# Altium schematic sheet Sheet4.SchDoc
size 420 x 297 mm; Author: ALTIUM GOSTBOM2.0 KEV; SheetNumber: 4; SheetTotal: 4; Обозначение_Код: ФЮРА.442576.001 Э3
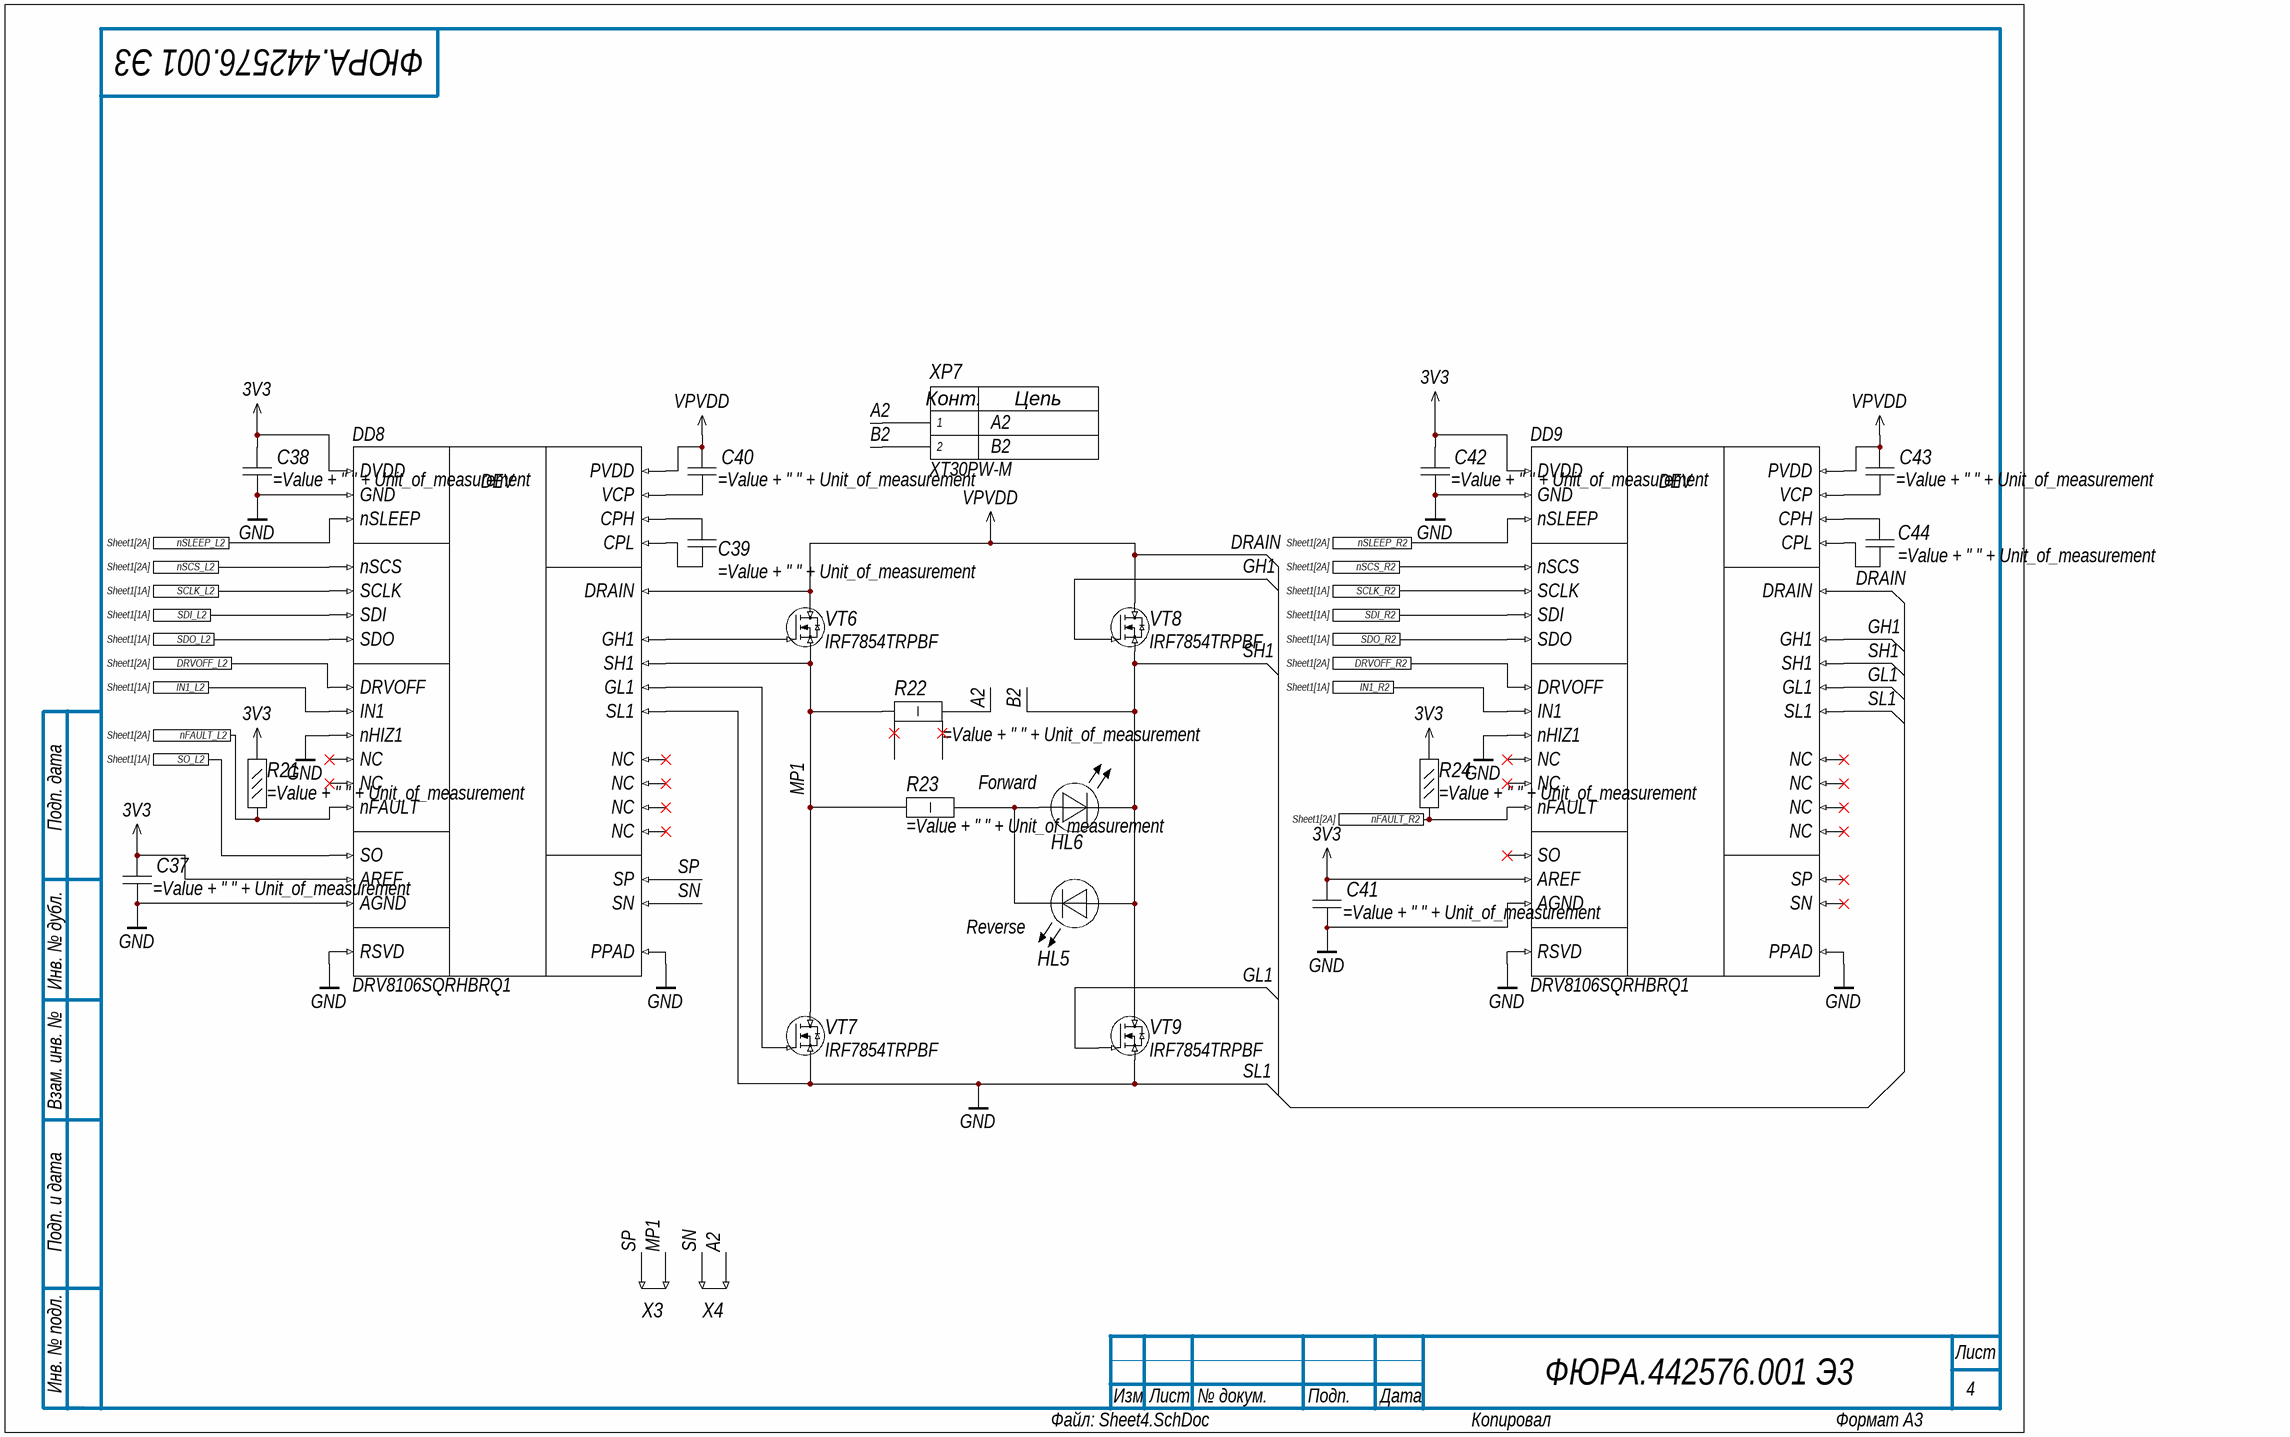
[diagram p0: Sheet4.SchDoc]

## Parts
C37  (no value)  [CAP_0603]
C38  (no value)  [CAP_0603]
C39  (no value)  [CAP_0603]
C40  (no value)  [CAP_0603]
C41  (no value)  [CAP_0603]
C42  (no value)  [CAP_0603]
C43  (no value)  [CAP_0603]
C44  (no value)  [CAP_0603]
DD8  DRV8106SQRHBRQ1  [VQFN32]
DD9  DRV8106SQRHBRQ1  [VQFN32]
HL5  3  [LED_0805]  (value not drawn)
HL6  3  [LED_0805]  (value not drawn)
R21  (no value)  [RES_0603]
R22  (no value)  [RES_2512]
R23  (no value)  [RES_2512]
R24  (no value)  [RES_0603]
VT6  IRF7854TRPBF  [SOP-8 WithoutTP]
VT7  IRF7854TRPBF  [SOP-8 WithoutTP]
VT8  IRF7854TRPBF  [SOP-8 WithoutTP]
VT9  IRF7854TRPBF  [SOP-8 WithoutTP]
X3  Обозначение при заказе  [NetTie]  (value not drawn)  (net tie, no BOM)
X4  Обозначение при заказе  [NetTie]  (value not drawn)  (net tie, no BOM)
XP7  XT30PW-M  [XT30PW-M]

## Ports
DRVOFF_L2 (see Sheet1[2A]), DRVOFF_R2 (see Sheet1[2A]), IN1_L2 (see Sheet1[1A]), IN1_R2 (see Sheet1[1A]), nFAULT_L2 (see Sheet1[2A]), nFAULT_R2 (see Sheet1[2A]), nSCS_L2 (see Sheet1[2A]), nSCS_R2 (see Sheet1[2A]), nSLEEP_L2 (see Sheet1[2A]), nSLEEP_R2 (see Sheet1[2A]), SCLK_L2 (see Sheet1[1A]), SCLK_R2 (see Sheet1[1A]), SDI_L2 (see Sheet1[1A]), SDI_R2 (see Sheet1[1A]), SDO_L2 (see Sheet1[1A]), SDO_R2 (see Sheet1[1A]), SO_L2 (see Sheet1[1A])

## Nets
3V3: C37.2 C38.2 C41.2 C42.2 DD8.2(DVDD) DD8.16(AREF) DD9.2(DVDD) DD9.16(AREF) R21.2 R24.2
DRAIN: C40.2 C43.2 DD8.28(DRAIN) DD8.29(PVDD) DD9.28(DRAIN) DD9.29(PVDD) VT6.3 VT8.3  [also labelled VPVDD]
SL1: C37.1 C38.1 C41.1 C42.1 DD8.0(PPAD) DD8.1(GND) DD8.8(nHIZ1) DD8.15(RSVD) DD8.17(AGND) DD8.23(SL1) DD9.0(PPAD) DD9.1(GND) DD9.8(nHIZ1) DD9.15(RSVD) DD9.17(AGND) DD9.23(SL1) VT7.2 VT9.2  [also labelled GND]
A2: R22.1 X4.2 XP7.1
B2: DD9.21(SH1) HL5.A HL6.C VT8.2 VT9.3 XP7.2  [also labelled SH1]
DRVOFF_L2: DD8.12(DRVOFF) ; port DRVOFF_L2
DRVOFF_R2: DD9.12(DRVOFF) ; port DRVOFF_R2
GH1: DD9.20(GH1) VT8.1
GL1: DD9.22(GL1) VT9.1
IN1_L2: DD8.7(IN1) ; port IN1_L2
IN1_R2: DD9.7(IN1) ; port IN1_R2
MP1: DD8.21(SH1) R22.2 R23.1 VT6.2 VT7.3 X3.2
nFAULT_L2: DD8.13(nFAULT) R21.1 ; port nFAULT_L2
nFAULT_R2: DD9.13(nFAULT) R24.1 ; port nFAULT_R2
nSCS_L2: DD8.3(nSCS) ; port nSCS_L2
nSCS_R2: DD9.3(nSCS) ; port nSCS_R2
nSLEEP_L2: DD8.11(nSLEEP) ; port nSLEEP_L2
nSLEEP_R2: DD9.11(nSLEEP) ; port nSLEEP_R2
SCLK_L2: DD8.4(SCLK) ; port SCLK_L2
SCLK_R2: DD9.4(SCLK) ; port SCLK_R2
SDI_L2: DD8.5(SDI) ; port SDI_L2
SDI_R2: DD9.5(SDI) ; port SDI_R2
SDO_L2: DD8.6(SDO) ; port SDO_L2
SDO_R2: DD9.6(SDO) ; port SDO_R2
SN: DD8.19(SN) X4.1
SO_L2: DD8.14(SO) ; port SO_L2
SP: DD8.18(SP) X3.1
NetC39_1: C39.1 DD8.32(CPL)
NetC39_2: C39.2 DD8.31(CPH)
NetC40_1: C40.1 DD8.30(VCP)
NetC43_1: C43.1 DD9.30(VCP)
NetC44_1: C44.1 DD9.32(CPL)
NetC44_2: C44.2 DD9.31(CPH)
NetDD8_20: DD8.20(GH1) VT6.1
NetDD8_22: DD8.22(GL1) VT7.1
NetHL5_C: HL5.C HL6.A R23.2

Not connected (* = marked no-connect by the designer): DD8 9(NC)* 10(NC)* 24(NC)* 25(NC)* 26(NC)* 27(NC)*; DD9 9(NC)* 10(NC)* 14(SO)* 18(SP)* 19(SN)* 24(NC)* 25(NC)* 26(NC)* 27(NC)*

## Notes on the sheet
- A2
- B2
- Forward
- (near HL5) Reverse
- Подп. дата
- Инв. № дубл.
- Взам. инв. №
- Подп. и дата
- Инв. № подл.
- Изм.
- Лист
- № докум.
- Подп.
- Дата
- ALTIUM GOSTBOM2.0 KEV
- Файл:
- Копировал
- Формат А3
- (in symbol DRV8106SQRHBRQ1) DEV
- (in symbol XT30PW-M) Конт.; Цепь

## Library data of the parts
C37 C38 C41 C42 = CAP_0603: Конденсатор керамический, типоразмера 0603; Value: 1; Unit_of_measurement: мкФ 6.3В; ComponentLink1Description: New link; ComponentLink1URL: *
C39 C44 = CAP_0603: Конденсатор керамический, типоразмера 0603; Value: 0,1; Unit_of_measurement: мкФ 50 В; ComponentLink1Description: New link; ComponentLink1URL: *
C40 C43 = CAP_0603: Конденсатор керамический, типоразмера 0603; Value: 1; Unit_of_measurement: мкФ 16 В; ComponentLink1Description: New link; ComponentLink1URL: *
DD8 DD9 = DRV8106SQRHBRQ1: Automotive, 40-V, half-bridge Smart Gate Driver w/offline diagnostics and inline current sense amp.
HL5 HL6 = LED_0805: Светодиод SMD 0805=2x1.3мм, красный, 28мкд, 130град, прозрачная линза; Q-15575B СД SMD02013C2\кр\ 28,5\130\пр\FYLS- 0805HD\FORYARD; Unit_of_measurement: Ом; Value: *; ComponentLink1Description: New link; ComponentLink1URL: *
R21 R24 = RES_0603: Резистор, типоразмера 0603; Value: 10; Unit_of_measurement: кОм; ComponentLink1Description: New link; ComponentLink1URL: *
R22 = ResShunt_2512: Резистор, типоразмера 2512; Value: 7.5; Unit_of_measurement: мОм; ComponentLink1Description: New link; ComponentLink1URL: *
R23 = RES_2512: Резистор, типоразмера 2512; Value: 1.8; Unit_of_measurement: кОм; ComponentLink1Description: New link; ComponentLink1URL: *
VT6-VT9 = IRF7854TRPBF: Транзистор, HEXFET, N-канал, 80В, 10А [SOIC-8]; pin to pad: 1>4 2>1+2+3 3>5+6+7+8
X3 X4 = NetTie: Описание свойств компонента
XP7 = XT30PW-M: Socket; DC supply; XT30; male; PIN: 2; on PCBs; THT; yellow; 15A; 500V